# Altium schematic sheet sch.SchDoc
size 431 x 279 mm; Organization: ORGANIZATION; Address1: ADDRESS 1; Address2: ADDRESS 2; Address3: ADDRESS 3; Address4: ADDRESS 4; Revision: -; ENG_APP_DATE: --/--/--; DSN_APP_DATE: --/--/--; CHK_APP_DATE: --/--/--
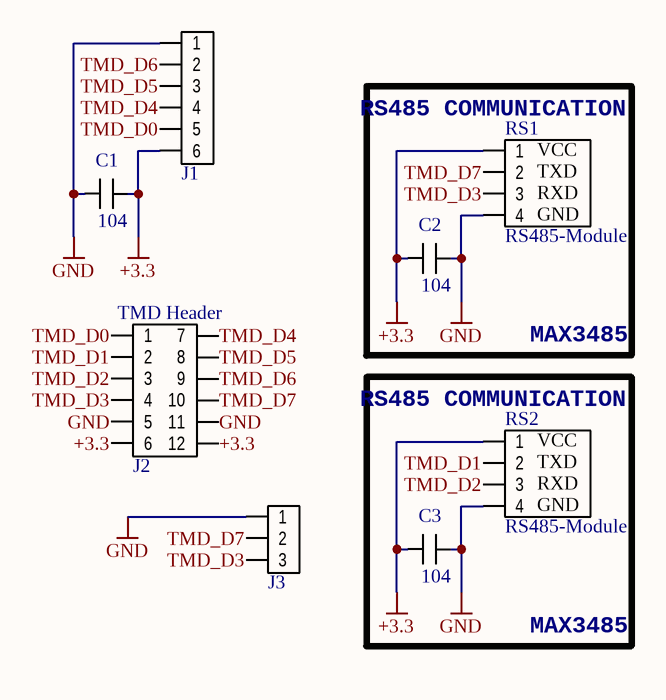
[diagram p0: sch.SchDoc]

## Parts
C1  104  [CAP-CERAMIC-100mil-BPAD]
C2  104  [CAP-CERAMIC-100mil-BPAD]
C3  104  [CAP-CERAMIC-100mil-BPAD]
J1  Header 6x1  [TER-J6x1-M-2.54mm-BPAD]  (value not drawn)
J2  TMD Header  [TER-J6x2-M-2.54mm-V-BPAD]
J3  Header 3x1  [TER-J3x1-M-2.54mm-BPAD]  (value not drawn)
RS1  RS485-Module  [COMM-RS485-to-TTL-MODULE-SIMPLIFIED-BPAD]
RS2  RS485-Module  [COMM-RS485-to-TTL-MODULE-SIMPLIFIED-BPAD]

## Nets
+3.3: C1.2 C2.1 C3.1 J1.6 J2.6 J2.12 RS1.1 RS2.1
GND: C1.1 C2.2 C3.2 J1.1 J2.5 J2.11 J3.1 RS1.4 RS2.4
TMD_D0: J1.5 J2.1
TMD_D1: J2.2 RS2.2
TMD_D2: J2.3 RS2.3
TMD_D3: J2.4 J3.3 RS1.3
TMD_D4: J1.4 J2.7
TMD_D5: J1.3 J2.8
TMD_D6: J1.2 J2.9
TMD_D7: J2.10 J3.2 RS1.2

## Notes on the sheet
- (near RS1) RS485 COMMUNICATION
- (near RS2) RS485 COMMUNICATION
- MAX3485
- 8
- 7
- 6
- 5
- 4
- 3
- DWG. NO.
- REV.
- SHT.
- 2
- 1
- THIS DOCUMENT AND THE DATA DISCLOSED HEREIN OR HEREWITH IS THE PROPERTY OF ALTIUM LIMITED AND MAY BE FREELY DISTRIBUTED IN WHOLE. NO RIGHTS ARE RESERVED OR EXPRESS OR IMPLIED WARANTEE GIVEN.
- REVISION
- DESCRIPTION
- DATE
- APPROVED
- F
- E
- D
- C
- B
- A
- TITLE
- SCALE:
- SIZE
- CAGE CODE
- FILE NAME
- DWG NO.
- SHEET
- OF
- REV
- (in symbol COMM RS485-to-TTL-simplified) VCC; TXD; RXD; GND

## Library data of the parts
C1-C3 = CAP: Capacitor
J2 = Header 6x2
RS1 RS2 = COMM RS485-to-TTL-simplified: https://www.thegioiic.com/products/mach-chuyen-doi-rs485-to-ttl